# EAGLE design laser_scanner (EAGLE 6.6.0)
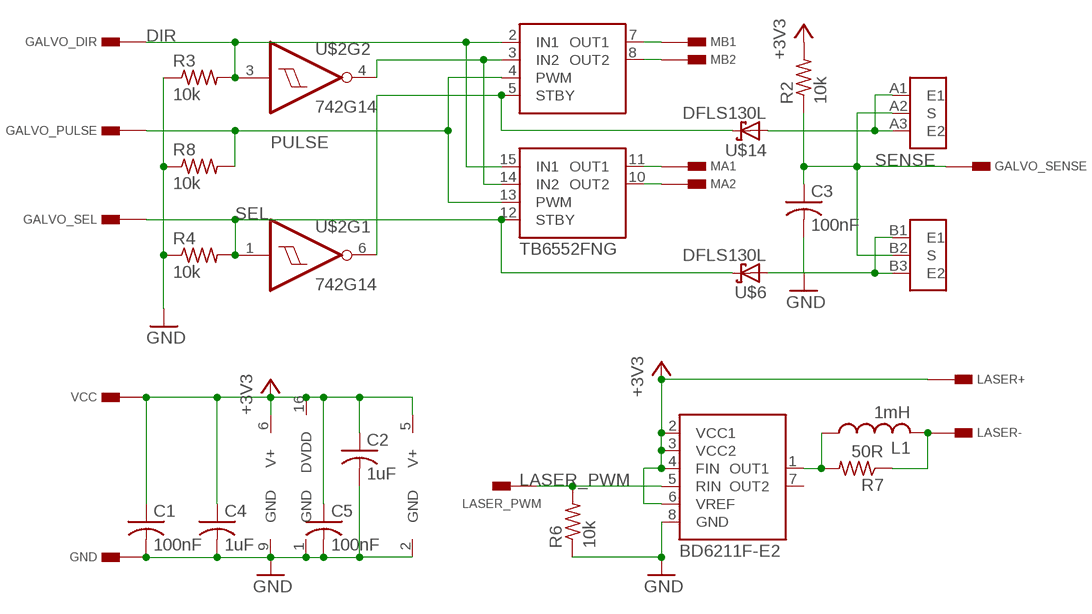
[diagram p0: schematic, sheet 1]

## Parts
C1  100nF  C-USC0603  [C0603]
C2  1uF  C-USC0603  [C0603]
C3  100nF  C-USC0603  [C0603]
C4  1uF  C-USC0603  [C0603]
C5  100nF  C-USC0603  [C0603]
GALVO_DIR  PAD-0.6_1.8  [PAD_0.6_1.8]
GALVO_PULSE  PAD-0.6_1.8  [PAD_0.6_1.8]
GALVO_SEL  PAD-0.6_1.8  [PAD_0.6_1.8]
GALVO_SENSE  PAD-0.6_1.8  [PAD_0.6_1.8]
GND  PAD-0.6_1.8  [PAD_0.6_1.8]
L1  1mH  L-US  [L7070]
LASER+  PAD-0.6_1.8  [PAD_0.6_1.8]
LASER-  PAD-0.6_1.8  [PAD_0.6_1.8]
LASER_PWM  PAD-0.6_1.8  [PAD_0.6_1.8]
MA1  PAD-0.6_1.8  [PAD_0.6_1.8]
MA2  PAD-0.6_1.8  [PAD_0.6_1.8]
MB1  PAD-0.6_1.8  [PAD_0.6_1.8]
MB2  PAD-0.6_1.8  [PAD_0.6_1.8]
R2  10k  R-US_R0603  [R0603]
R3  10k  R-US_R0603  [R0603]
R4  10k  R-US_R0603  [R0603]
R6  10k  R-US_R0603  [R0603]
R7  50R  R-US_R0603  [R0603]
R8  10k  R-US_R0603  [R0603]
U$1  TB6552  [TSSOP16]
U$2  742G14  [SOT23-6]
U$3  BD6211  [SOP-08]
U$6  DFLS130L  [POWERDI323]
U$7  LASER_SLIDER  [LASER_SCANNER]
U$14  DFLS130L  [POWERDI323]
VCC  PAD-0.6_1.8  [PAD_0.6_1.8]

## Nets
+3V3: C1.1 C2.1 C4.1 C5.1 LASER+.1 R2.2 U$1.6(PWR:V+) U$1.16(DPWR:DVDD) U$2.5(PWR:V+) U$3.2(VCC1) U$3.3(VCC2) U$3.4(FIN) U$3.6(VREF) VCC.1
DIR: GALVO_DIR.1 R3.2 U$1.2(A:IN1) U$1.15(B:IN1) U$2.3(I)
GND: C1.2 C2.2 C3.2 C4.2 C5.2 GND.1 R3.1 R4.1 R6.1 R8.1 U$1.1(DPWR:GND) U$1.9(PWR:GND) U$2.2(PWR:GND) U$3.8(GND)
LASER_PWM: LASER_PWM.1 R6.2 U$3.5(RIN)
N$1: MB1.1 U$1.7(A:OUT1)
N$2: MB2.1 U$1.8(A:OUT2)
N$3: MA1.1 U$1.11(B:OUT1)
N$4: MA2.1 U$1.10(B:OUT2)
N$5: U$1.3(A:IN2) U$1.14(B:IN2) U$2.4(O)
N$11: U$7.A1(A:E1) U$7.A3(A:E2) U$14.A
N$12: L1.1 R7.2 U$3.1(OUT1)
N$13: U$6.A U$7.B1(B:E1) U$7.B3(B:E2)
N$15: L1.2 LASER-.1 R7.1
N$17: U$1.5(A:STBY) U$2.6(O) U$14.C
PULSE: GALVO_PULSE.1 R8.2 U$1.4(A:PWM) U$1.13(B:PWM)
SEL: GALVO_SEL.1 R4.2 U$1.12(B:STBY) U$2.1(I) U$6.C
SENSE: C3.1 GALVO_SENSE.1 R2.1 U$7.A2(A:S) U$7.B2(B:S)
Unconnected: U$3.7(OUT2)

## Notes on the sheet
- TB6552FNG
- BD6211F-E2

## Library data of the parts
C1-C5 = rcl:C-US: CAPACITOR, American symbol
GALVO_DIR GALVO_PULSE GALVO_SEL GALVO_SENSE GND LASER+ LASER- LASER_PWM MA1 MA2 MB1 MB2 VCC = modular_robotics:PAD
L1 = modular_robotics:L-US: INDUCTOR, American symbol
R2-R4 R6-R8 = rcl:R-US_: RESISTOR, American symbol
U$1 = modular_robotics:TB6552
U$2 = modular_robotics:74*2G14
U$3 = modular_robotics:BD6211
U$6 U$14 = modular_robotics:DFLS130L
U$7 = modular_robotics:LASER_SLIDER

## Board
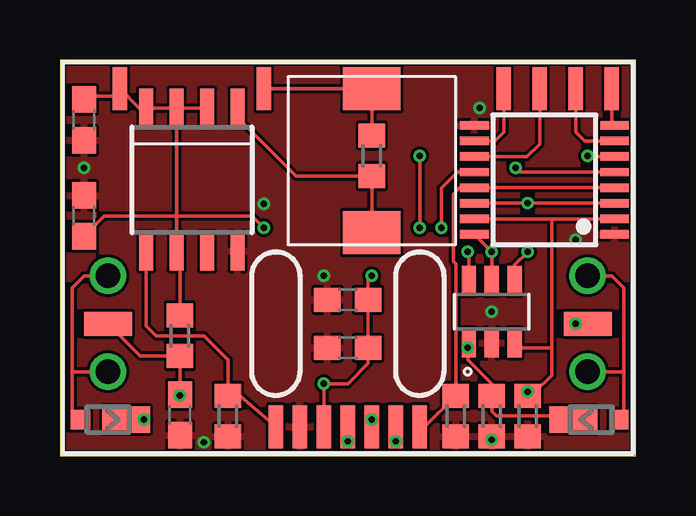
[diagram p1: board, top side]
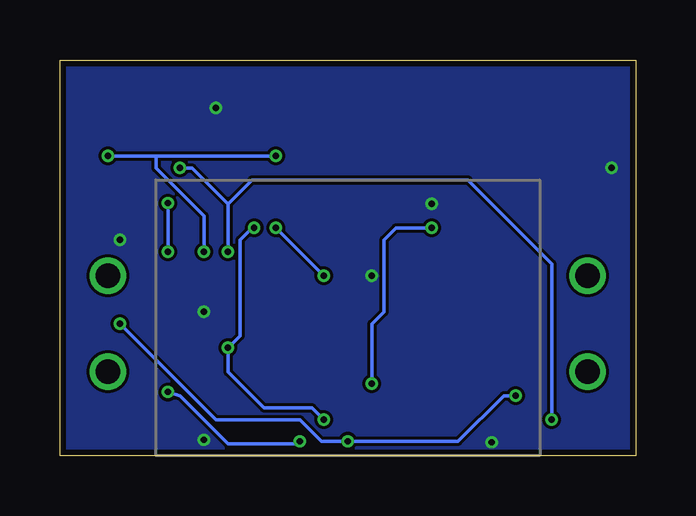
[diagram p2: board, bottom side, seen from below]

Size 24 x 16.5 mm. Coordinates in mm from the lower left corner, seen from the top.
Outline: 0,0 24,0 24,16.5 0,16.5 0,0
Copper layers (1*16): Top 0.035mm / dielectric 1.5mm / Bottom 0.035mm
Design rules "bay_area_circuits *": minimum track width 5mil, minimum drill 10mil, track to track 5mil, track to pad 5mil, pad to pad 5mil, via to via 5mil, smd to smd 5mil, copper to edge 10mil, drill to drill 10mil, minimum pad ring 5mil, minimum via ring 5mil, stop-mask expansion 4mil, vias tented up to drill 5mil, thermal gap 5mil

### Footprints (pad centres in the part's own frame; a part is rotated, then mirrored left to right if it is on the bottom)
C0603 = smd 1.1 x 1: 1 -0.85,0; 2 0.85,0
PAD_0.6_1.8 = smd 0.6 x 1.8: 1 0,0
L7070 = smd 2.4 x 1.8: 1 0,3; 2 0,-3
R0603 = smd 1 x 1.1: 1 -0.85,0; 2 0.85,0
TSSOP16 = smd 0.35 x 1.2: 1 -2.275,-2.925; 2 -1.625,-2.925; 3 -0.975,-2.925; 4 -0.325,-2.925; 5 0.325,-2.925; 6 0.975,-2.925; 7 1.625,-2.925; 8 2.275,-2.925; 9 2.275,2.925; 10 1.625,2.925; 11 0.975,2.925; 12 0.325,2.925; 13 -0.325,2.925; 14 -0.975,2.925; 15 -1.625,2.925; 16 -2.275,2.925
SOT23-6 = smd 0.6 x 1.2: 1 -0.95,-1.306; 2 0,-1.306; 3 0.95,-1.306; 4 0.95,1.306; 5 0,1.306; 6 -0.95,1.306
SOP-08 = smd 0.6 x 1.6: 1 -1.905,-3; 2 -0.635,-3; 3 0.635,-3; 4 1.905,-3; 5 1.905,2.975; 6 0.635,2.975; 7 -0.635,2.975; 8 -1.905,2.975
POWERDI323 = smd 0.8 x 0.8: A 1.15,0 | smd 2 x 1.1: C -0.75,0
LASER_SCANNER = drill 1.016: A1 -10,2; A3 -10,-2; B1 10,2; B3 10,-2 | smd 2 x 1: A2 -10,0; B2 10,0

### Placement (x,y rotation side)
C1  12,6.5 180 top
C2  12,4.5 180 top
C3  5,1.7 270 top
C4  1,10 90 top
C5  1,14 270 top
GALVO_DIR  14,1.2 180 top
GALVO_PULSE  15,1.2 180 top
GALVO_SEL  13,1.2 180 top
GALVO_SENSE  12,1.2 0 top
GND  10,1.2 180 top
L1  13,12.3 180 top
LASER+  2.5,15.3 0 top
LASER-  8.5,15.3 180 top
LASER_PWM  9,1.2 180 top
MA1  20,15.3 0 top
MA2  18.5,15.3 0 top
MB1  21.5,15.3 180 top
MB2  23,15.3 180 top
R2  5,5 90 top
R3  19.5,1.65 90 top
R4  18,1.65 90 top
R6  7,1.65 90 top
R7  13,12.5 270 top
R8  16.5,1.65 90 top
U$1  20.2,11.5 90 top
U$2  18,6 0 top
U$3  5.5,11.5 180 top
U$6  22.15,1.5 0 top
U$7  12,5.5 0 top
U$14  2,1.5 180 top
VCC  11,1.2 180 top

### Tracks (layer width: path | path; a pad name or v marks a point on that pad's centre or on a via)
+3V3  (via drill 0.25)
  Top 0.15: R2.2 5,7.79 U$3.6 4.87,10 | 4.87,10 U$3.3 | U$3.3 U$3.4 3.3,14.5 LASER+.1 2.5,15 1.15,15 C5.1 | U$3.3 U$3.2 | U$1.6 22.02,12.47 v22,12.5 | U$2.5 v18,8.5 U$1.16 | v15,9.5 v15,12.5 | v13,7.5 12.85,7.35 C1.1 C2.1 12.85,3.85 12,3 v11,3 VCC.1 | v8.5,9.5 8,10 4.87,10 | 4.87,10 1.85,10 C4.1
  Bottom 0.15: v18,8.5 18,10 20,12 20,12.5 | 20,12.5 v22,12.5 | v13,7.5 v15,9.5 | v15,12.5 20,12.5 | v11,3 11,5.5 10.5,6 10.5,9 10,9.5 v8.5,9.5
DIR  (via drill 0.25)
  Top 0.15: U$1.15 20.5,9.88 | 20.5,9.88 U$1.2 | 20.5,4.5 20.5,3.35 19.8,2.65 v19.5,2.65 R3.2 | 20.5,4.5 20.5,9.88 | U$2.3 19.14,4.5 20.5,4.5 | GALVO_DIR.1 v14,0.6
  Bottom 0.15: v19.5,2.65 19,2.5 17,0.5 14.1,0.5 arc-90 v14,0.6
GND  (via drill 0.25)
  other vias: 21.5,9 17.5,14.5 18,6 11,7.5 18,0.65 6,0.55 1,12 8.5,10.5
  pour Top: 0,0 24,0 24,16.5 0,16.5
  pour Bottom: 24,0 24,16.5 0,16.5 0,0
LASER_PWM
  Top 0.15: U$3.5 3.6,5.41 4,5 6,5 7,4 R6.2 7.5,2.5 LASER_PWM.1
N$1
  Top 0.15: U$1.7 21.88,13.12 21.5,13.5 MB1.1
N$2
  Top 0.15: MB2.1 23,13.9 U$1.8
N$3
  Top 0.15: U$1.11 19.48,12.47 20,13 MA1.1
N$4
  Top 0.15: U$1.10 18.12,13.12 18.5,13.5 MA2.1
N$5  (via drill 0.25)
  Top 0.15: U$1.14 v19.5,10.53 U$1.3 | U$2.4 18.95,7.95 v19.5,8.5
  Bottom 0.15: v19.5,8.5 v19.5,10.53
N$11
  Top 0.15: U$14.A 0.5,1.85 0.5,3.5 | 0.5,3.5 0.5,7 1,7.5 U$7.A1 | U$7.A3 0.5,3.5
N$12
  Top 0.15: U$3.1 7.5,15.01 7.5,14 9.85,11.65 R7.2 L1.1
N$13
  Top 0.15: 23.5,3.5 23.5,7 23,7.5 U$7.B1 | 23.5,3.5 23.5,1.85 arc-90 U$6.A | U$7.B3 23.5,3.5
N$15
  Top 0.15: R7.1 L1.2 LASER-.1
N$17  (via drill 0.25)
  Top 0.15: U$2.6 17.05,8.45 v17,8.5 | v19,12 19.18,11.82 U$1.5 | U$14.C v3.5,1.5
  Bottom 0.15: v17,8.5 17,10.5 | v3.5,1.5 3.5,8 7,11.5 16,11.5 17,10.5 | v19,12 18.5,12 17,10.5
PULSE
  Top 0.15: U$1.4 U$1.13 16.68,11.18 16.4,10.9 16.4,8.1 16.5,8 R8.2 15.2,1.2 GALVO_PULSE.1
SEL  (via drill 0.25)
  Top 0.15: U$2.1 17,4.64 v17,4.5 17,4 18,3 R4.2 18,1.85 18.2,1.65 21.25,1.65 U$6.C | U$1.12 16.57,11.82 15.9,11.15 v15.9,9.5 | GALVO_SEL.1 v13,1.5
  Bottom 0.15: v13,1.5 13.5,2 15.5,2 17,3.5 v17,4.5 16.5,5 16.5,9 16,9.5 v15.9,9.5
SENSE  (via drill 0.25)
  Top 0.15: U$7.A2 3.35,4.15 R2.1 v5,2.5 C3.1 | U$7.B2 v21.5,5.5 | GALVO_SENSE.1 v12,0.6
  Bottom 0.15: v21.5,5.5 17.5,1.5 14,1.5 13.1,0.6 v12,0.6 7.4,0.6 5.5,2.5 v5,2.5